# EasyEDA Pro project boat_2.eprj

# Schematic Schematic
Board Name: Boat_V_2; Create Date: 2025-10-07; Page Name: P1; Project Name: boat_2; Schematic Name: Schematic; Update Date: 2026-01-03; Company: EasyEDA.com; Page Size: A4; Version: V1.0
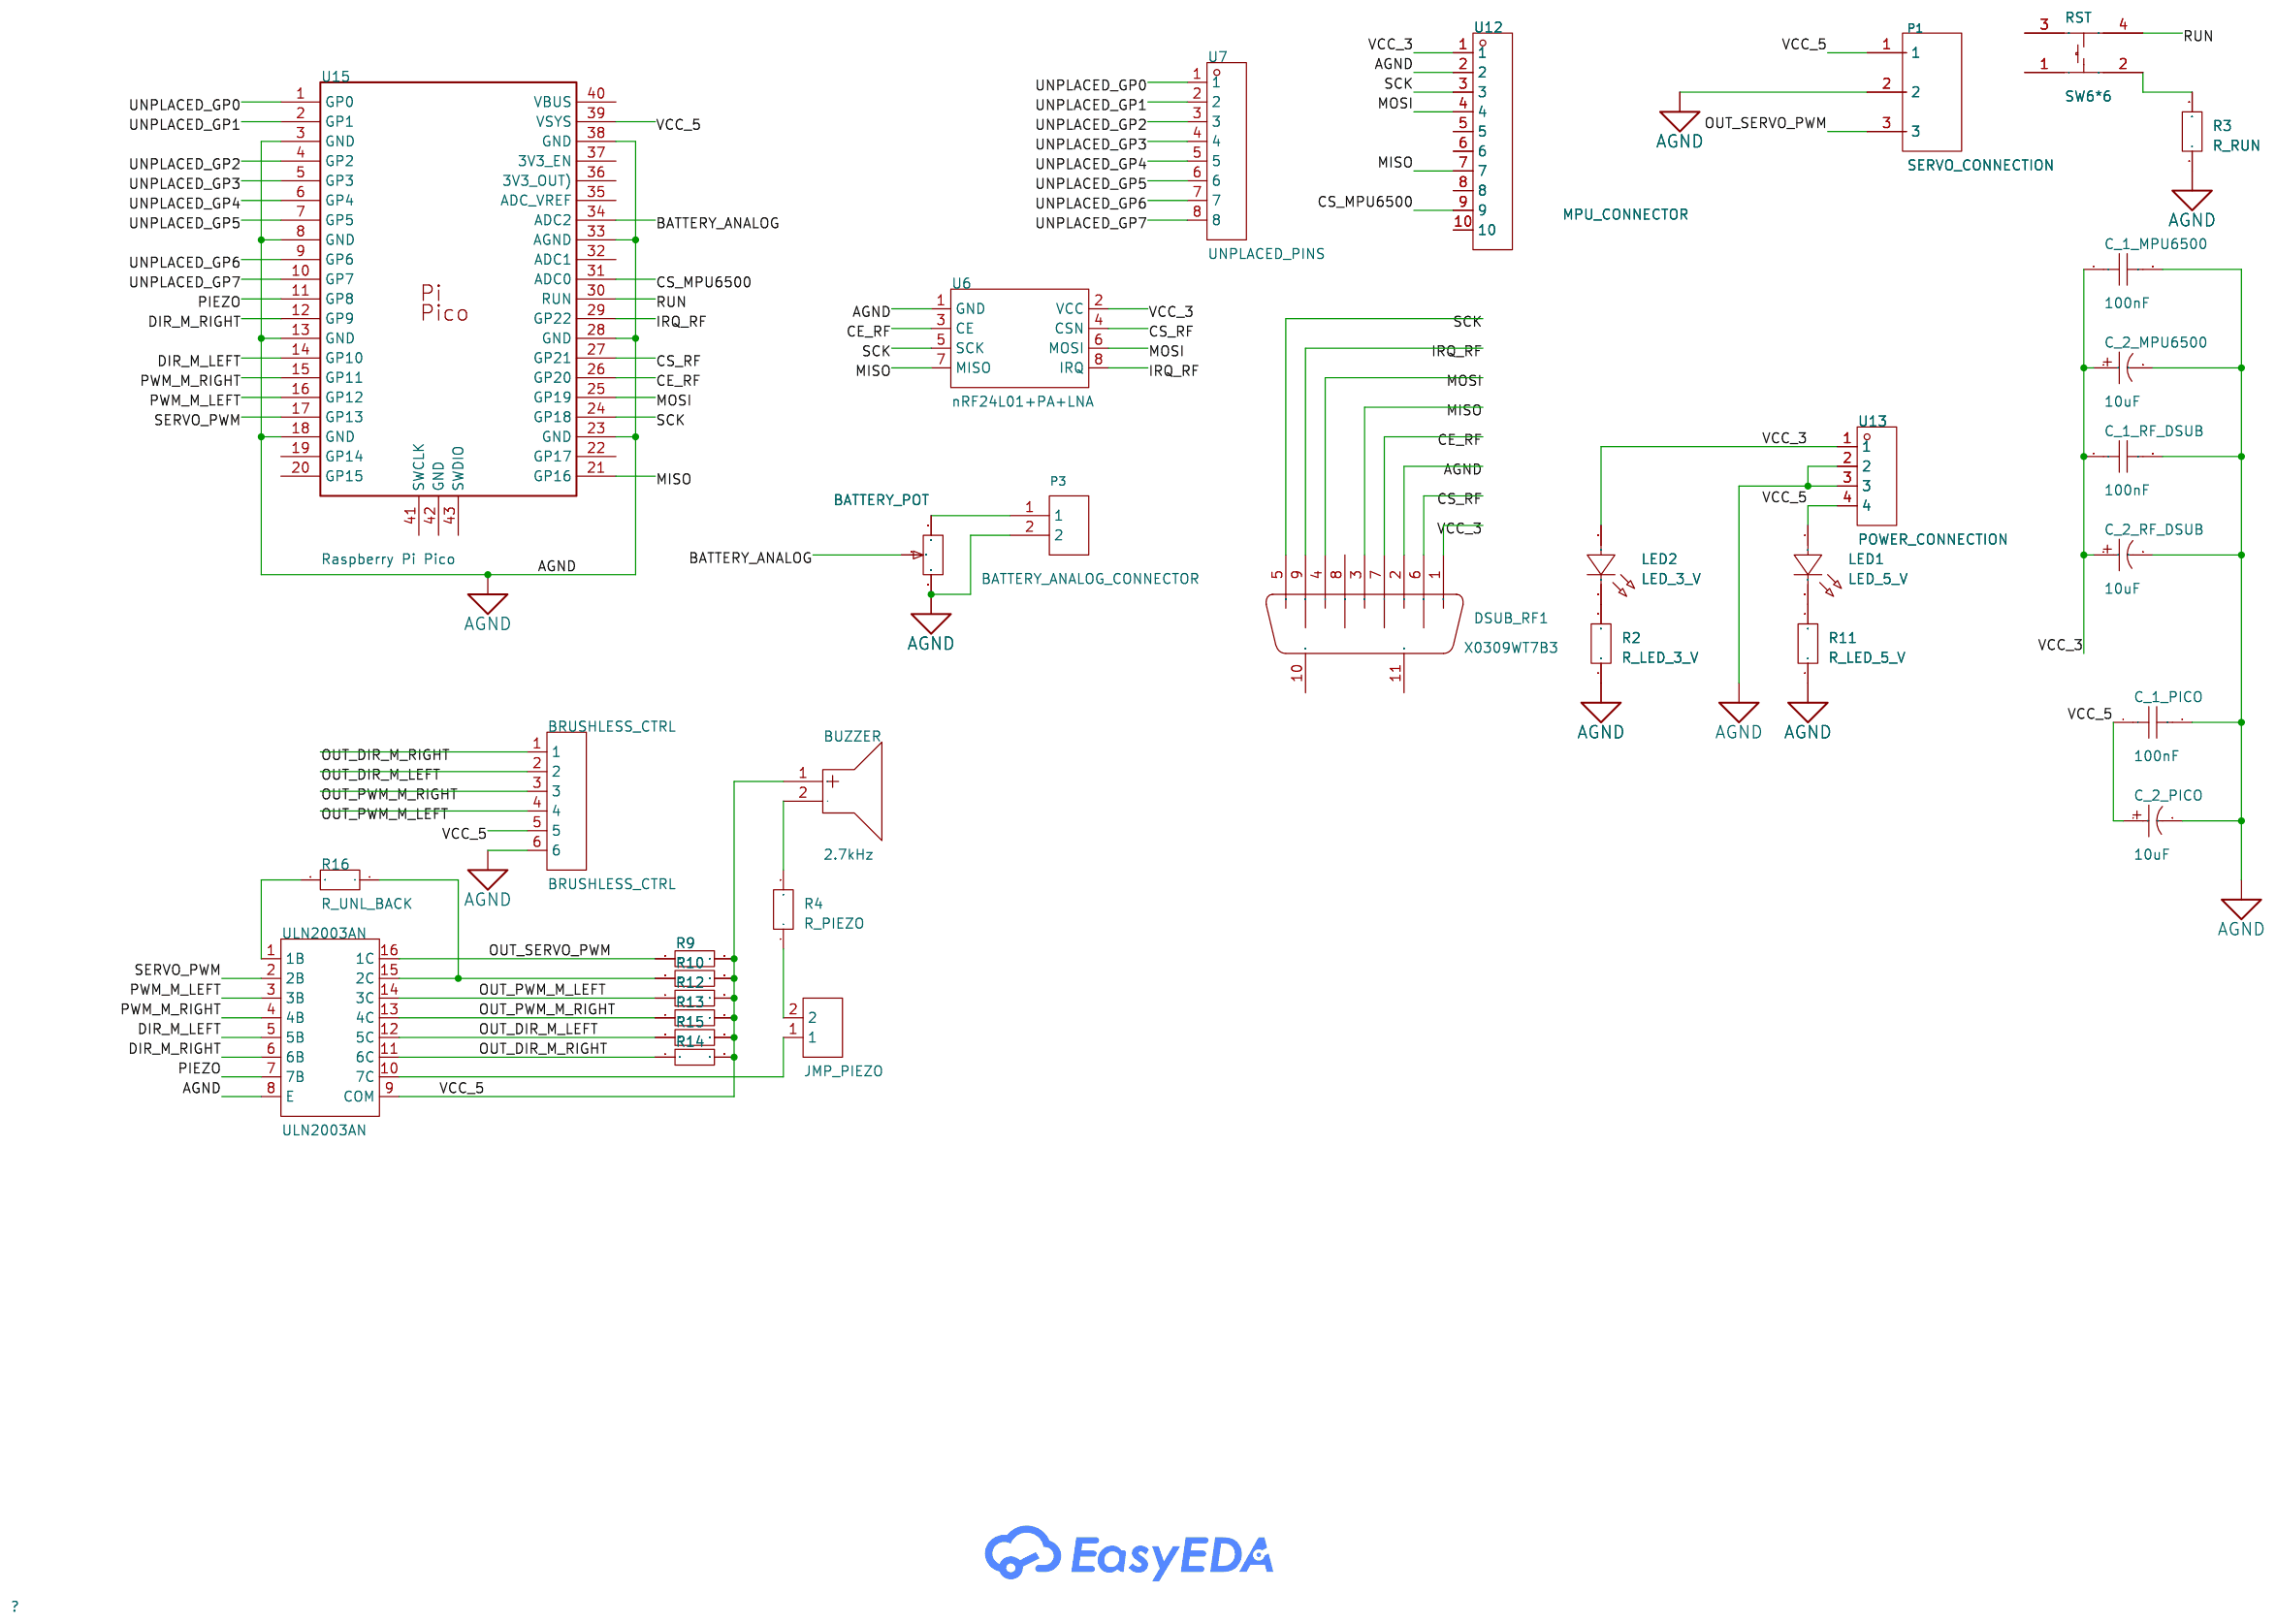
[diagram p0: schematic sheet]

## Parts
BRUSHLESS_CTRL  BRUSHLESS_CTRL  [CONN-TH_6P-P2.50_BX-XH2.54-6PZZ]
BUZZER  2.7kHz  [BUZ-TH_BD9.0-P5.00-D0.6-FD]
C_1_MPU6500  100nF  [CAP-TH_L5.8-W3.6-P5.0-D0.6]
C_1_PICO  100nF  [CAP-TH_L5.8-W3.6-P5.0-D0.6]
C_1_RF_DSUB  100nF  [CAP-TH_L5.8-W3.6-P5.0-D0.6]
C_2_MPU6500  10uF  [CAP-TH_BD5.0-P2.00-D0.5-FD]
C_2_PICO  10uF  [CAP-TH_BD5.0-P2.00-D0.5-FD]
C_2_RF_DSUB  10uF  [CAP-TH_BD5.0-P2.00-D0.5-FD]
DSUB_RF1  X0309WT7B3  [DB9-TH_X0309WT7B3]
H2  JMP_PIEZO  [HDR-TH_2P-P2.54-V-M]
LED1  LED_5_V  [LED-TH_BD5.5-P2.54_SFH-4545]
LED2  LED_3_V  [LED-TH_BD5.5-P2.54_SFH-4545]
P1  SERVO_CONNECTION  [CONN-TH_3P-P5.00_WJ126V-5.0-3P]
P3  BATTERY_ANALOG_CONNECTOR  [CONN-TH_2P-P5.00_WJ301V-5.00-2P]
R1  20kΩ  [RES-ADJ-TH_3296X]
R2  10kΩ  [RES-TH_BD2.7-L6.2-P10.20-D0.4]
R3  10kΩ  [RES-TH_BD2.7-L6.2-P10.20-D0.4]
R4  10kΩ  [RES-TH_BD2.7-L6.2-P10.20-D0.4]
R9  UNL_PULLUP  [RES-TH_BD2.7-L6.2-P10.20-D0.4]
R10  UNL_PULLUP  [RES-TH_BD2.7-L6.2-P10.20-D0.4]
R11  10kΩ  [RES-TH_BD2.7-L6.2-P10.20-D0.4]
R12  UNL_PULLUP  [RES-TH_BD2.7-L6.2-P10.20-D0.4]
R13  UNL_PULLUP  [RES-TH_BD2.7-L6.2-P10.20-D0.4]
R14  UNL_PULLUP  [RES-TH_BD2.7-L6.2-P10.20-D0.4]
R15  UNL_PULLUP  [RES-TH_BD2.7-L6.2-P10.20-D0.4]
R16  10kΩ  [RES-TH_BD2.7-L6.2-P10.20-D0.4]
RST  SW6*6  [KEY-TH_4P-L6.0-W6.0-P4.5-LS6.5-TL]
U6  nRF24L01+PA+LNA  [COMM-TH_L41.0-W15.5-P2.54_NRF24L01]
U7  UNPLACED_PINS  [HDR-TH_8P-P2.54-V-F]
U12  MPU_CONNECTOR  [HDR-TH_10P-P2.54-V-F]
U13  POWER_CONNECTION  [CONN-TH_DB128V-5.0-4P]
U15  Raspberry Pi Pico  [RASPBERRY PI PICO FOOTPRINT]
ULN2003AN  ULN2003AN  [DIP-16_L19.7-W6.6-P2.54-LS7.6-BL]

## Library data of the parts
BRUSHLESS_CTRL = BX-XH2.54-6PZZ: LCSC Part Name: 1x6P 间距:2.5mm 直插 系列:XH; Supplier Part: C18077837; Manufacturer: Bossie(博锡); Supplier Footprint: 插件,P=2.54mm; JLCPCB Part Class: Extended Part; Datasheet: https://item.szlcsc.com/datasheet/BX-XH2.54-6PZZ/19218238.html; Supplier: LCSC; Pins Structure: 1x6P; Pitch: 2.5mm; Mounting Type: Through Hole; Reference Series: XH; Number of Pins: 6P; Number of Rows: 1; Number of PINs Per Row: 6; Current Rating: 3A; Contact Material: Brass; Contact Plating: Tin; Operating Temperature: -25℃~+85℃; Voltage Rating: 250V; Plastic Material: PA66; Flame Retardant Rating: UL94V-0; Color: White; Z-Height of the Board: 7mm; X-Length of Bottom Edge on Board (Spacing Line): 17.5mm; Y-Width of Bottom Edge on Board: 5.9mm
BUZZER = FMB09A03-3V: LCSC Part Name: 电磁式3V 2700HZ; Supplier Part: C417385; Manufacturer: FUET(福声科技); Supplier Footprint: 插件,D=9mm; JLCPCB Part Class: Extended Part; Datasheet: https://item.szlcsc.com/datasheet/FMB09A03-3V/410518.html; Supplier: LCSC; Driver Circuitry: Active Buzzer (Built-in Driving Circuit); Technology: Electromagnetic; Voltage - Supply: 2V~4.2V; Sound Pressure Level(SPL): 80dB; Diameter(φD): 9mm; Height: 5.7mm
C_1_MPU6500 C_1_PICO C_1_RF_DSUB = 178MU0002: LCSC Part Name: 100nF ±10% 50V; Supplier Part: C5632426; Manufacturer: KNSCHA(科尼盛); Supplier Footprint: 插件,P=5.08mm; JLCPCB Part Class: Extended Part; Datasheet: https://item.szlcsc.com/datasheet/178MU0002/6552581.html; Supplier: LCSC; Tolerance: ±10%; Voltage Rating: 50V; Temperature Coefficient: X7R; Pin Spacing: 5.08mm
C_2_MPU6500 C_2_PICO C_2_RF_DSUB = 35ZLH220MEFC8X11.5: LCSC Part Name: 220uF ±20% 35V; Supplier Part: C107639; Manufacturer: Rubycon(红宝石); Supplier Footprint: 插件,D8xL11.5mm; JLCPCB Part Class: Extended Part; Datasheet: https://item.szlcsc.com/datasheet/35ZLH220MEFC8X11.5/108858.html; Supplier: LCSC; Tolerance: ±20%; Voltage Rating: 35V; Ripple Current: 472.5mA@120Hz; Pin Spacing: 3.5mm; Diameter: 8mm; Height - Seated (Max): 11.5mm; Lifetime: 8000hrs@105℃; Operating Temperature: -40℃~+105℃
DSUB_RF1 = X0309WT7B3: Connector Type:常规D-Sub Gender:Male Number of Pins:9P Mounting Style:Bend insert Number of Rows:2 Current Rating-Signal (Max):5A Current Rating-Power (Max):- Rated Voltage (Max):250V Colour:Black Operating Temperature Range:-55℃~+105℃ Operating Temperature; LCSC Part Name: D-Sub 公 P数:9P; Supplier Part: C2917296; Manufacturer: XKB Connection(中国星坤); Supplier Footprint: 弯插; JLCPCB Part Class: Extended Part; Datasheet: https://atta.szlcsc.com/upload/public/pdf/source/20220330/3C975A3D9B2321449830197EB58FD303.pdf; Supplier: LCSC; Connector Type: 常规D-Sub; Gender: Male; Number of Pins: 9P; Mounting Style: Bend insert; Number of Rows: 2; Current Rating-Signal (Max): 5A; Rated Voltage (Max): 250V; Colour: Black; Operating Temperature Range: -55℃~+105℃
H2 = PZ254V-11-02P: LCSC Part Name: 1x2P 间距:2.54mm 方针 直插; Supplier Part: C492401; Manufacturer: XFCN(兴飞); Supplier Footprint: 插件,P=2.54mm; JLCPCB Part Class: Extended Part; Datasheet: https://item.szlcsc.com/datasheet/PZ254V-11-02P/502957.html; Supplier: LCSC; Pin Structure: 1x2P; Pitch: 2.54mm; Circluar Pins/Square Pins: Pin Header; Mounting Type: Through Hole; Number of Rows: 1; Number of Pins: 2P; Length of Mating Pin: 6mm; Insulation Height: 2.5mm; Length of End Connection Pin: 3mm; Contact Material: Brass; Operating Temperature: -40℃~+105℃; Color: Black
LED1 LED2 = SLR-56MG3F: LCSC Part Name: 普绿/黄绿; Supplier Part: C2846650; Manufacturer: ROHM(罗姆); Supplier Footprint: 插件,D=5mm; JLCPCB Part Class: Extended Part; Datasheet: https://item.szlcsc.com/datasheet/SLR-56MG3F/3041319.html; Supplier: LCSC; Lamp Holder Type: 5mm Round Lens; Illumination Color: Yellow Green; Power(Watts): 75mW; Forward Current: 10mA; Peak Wavelength: 563nm; Viewing Angle: 40°; Operating Temperature: -20℃~+85℃
P1 = WJ126V-5.0-3P: LCSC Part Name: 5mm 1x3P 排数:1 每排P数:3 直插; Supplier Part: C8401; Manufacturer: KANGNEX(康奈克斯电气); Supplier Footprint: 插件,P=5mm; JLCPCB Part Class: Extended Part; Datasheet: https://atta.szlcsc.com/upload/public/pdf/source/20191225/C8401_BC4AEF85CCBF7CDF5CCE64583ADD1E63.pdf; Supplier: LCSC; Structure: 1x3P; Pitch: 5mm; Color: Green; Mounting Style: Straight; Current Rating (Max): 18A; Voltage Rating (Max): 250V; Number of Pins: 3P; Number of Rows: 1; Wire Gauge - AWG: 14~26; Wire Gauge - mm2: 2.5; Number of PINs Per Row: 3; Operating Temperature Range: -40℃~+105℃
P3 = WJ301V-5.0-2P: LCSC Part Name: 5mm 1x2P 排数:1 每排P数:2 直插; Supplier Part: C8475; Manufacturer: KANGNEX(康奈克斯电气); Supplier Footprint: 插件,P=5mm; JLCPCB Part Class: Extended Part; Datasheet: https://item.szlcsc.com/datasheet/WJ301V-5.0-2P/8969.html; Supplier: LCSC; Number of Positions or Pins: 1x2P; Pitch: 5mm; Color: Blue; Mounting Type: Through Hole; Number of Pins: 2P; Number of Rows: 1; Number of PINs Per Row: 2; Current Rating: 17.5A; Voltage Rating (Max): 250V; Wire Gauge - AWG: 14~22; Wire Gauge - mm2: 1.5; Operating Temperature: -30℃~+120℃
R1 = 3296X-203: LCSC Part Name: 3296X 20KΩ±10%; Supplier Part: C48641797; Manufacturer: BAOTER(宝特); Supplier Footprint: 插件-3P,9.5x4.8mm; JLCPCB Part Class: Extended Part; Datasheet: https://item.szlcsc.com/datasheet/3296X-203/50920059.html; Supplier: LCSC; Tolerance: ±10%; Power(Watts): 500mW; Temperature Coefficient: ±250ppm/℃; Number of Turns: 28
R2-R4 R11 R16 = MF02SFF1002A10: Supplier Part: C20625289; Manufacturer: UNI-ROYAL(厚声); Supplier Footprint: DIP; JLCPCB Part Class: Extended Part; Datasheet: https://item.szlcsc.com/datasheet/MF02SFF1002A10/22028782.html; Supplier: LCSC; Type: Metal Film Resistor; Tolerance: ±1%; Power(Watts): 2W; Temperature Coefficient: ±50ppm/℃
R9 R10 R12-R15 = Res_0603: Supplier Footprint: 0603
RST = SW6*6: Supplier Part: C9900009250; Supplier Footprint: SW-TH; JLCPCB Part Class: Extended Part; Supplier: LCSC
U6 = nRF24L01+PA+LNA: Supplier Part: C9900187674; JLCPCB Part Class: Extended Part; Supplier: LCSC
U7 = 8Pin排母,间距2.54mm,高5.0mm: Supplier Part: C9900020870; Supplier Footprint: HDR-TH; JLCPCB Part Class: Extended Part; Supplier: LCSC
U12 = PM254-1-10-Z-8.5: LCSC Part Name: 1x10P 间距:2.54mm 直插; Supplier Part: C2897373; Manufacturer: HCTL(华灿天禄); Supplier Footprint: 插件,P=2.54mm; JLCPCB Part Class: Extended Part; Datasheet: https://item.szlcsc.com/datasheet/PM254-1-10-Z-8.5/3142378.html; Supplier: LCSC; Holes Structure: 1x10P; Pitch: 2.54mm; Circular Hole / Square Hole: Square Hole; Mounting Type: Through Hole; Number of Rows: 1; Number of Positions: 10P; Current Rating: 3A; Holes Direction: Top; Insulation Height: 8.5mm; Contact Material: Copper Alloy; Operating Temperature: -40℃~+105℃
U13 = DB128V-5.0-4P-GN-S: LCSC Part Name: 1x4P 5mm 直插 排数:1 每排P数:4; Supplier Part: C424682; Manufacturer: DORABO(地博电气); Supplier Footprint: 插件,P=5mm; JLCPCB Part Class: Extended Part; Datasheet: https://item.szlcsc.com/datasheet/DB128V-5.0-4P-GN-S/418351.html; Supplier: LCSC; Number of Positions or Pins: 1x4P; Pitch: 5mm; Color: Green; Mounting Type: Through Hole; Number of Pins: 4P; Number of Rows: 1; Number of PINs Per Row: 4; Screw Specification: M2.5; Current Rating: 16A; Voltage Rating (Max): 300V; Wire Gauge - AWG: 12~22; Wire Gauge - mm2: 2.5; Operating Temperature: -40℃~+105℃
U15 = Raspberry Pi Pico: Manufacturer: Raspberry Pi; Manufacturer Part: Pi Pico; Supplier: Core Electronics; Supplier Part: Pi Pico; link: https://www.raspberrypi.org/documentation/rp2040/getting-started/
ULN2003AN = ULN2003AN_C7432319: LCSC Part Name: 七路高增益达林顿阵列功率驱动集成电路; Supplier Part: C7432319; Manufacturer: HGSEMI(华冠); Supplier Footprint: DIP-16; JLCPCB Part Class: Extended Part; Datasheet: https://item.szlcsc.com/datasheet/ULN2003AN/8436768.html; Supplier: LCSC; number of channels: 7; Collector - Emitter Voltage VCEO: 50V; Current - Collector(Ic): 500mA; Voltage - Input(Max): 30V; Operating Temperature: -40℃~+85℃; Output Leakage Current(Icex): 20uA; Input Current(on): 0.93mA; Input Current(off): 100uA

## Nets
AGND: BRUSHLESS_CTRL.6 C_1_MPU6500.2 C_1_PICO.2 C_1_RF_DSUB.2 C_2_MPU6500.2 C_2_PICO.2 C_2_RF_DSUB.2 DSUB_RF1.2 P1.2 P3.2 R1.3 R2.1 R3.1 R11.1 U6.1(GND) U12.2 U13.2 U13.3 U15.3(GND) U15.8(GND) U15.13(GND) U15.18(GND) U15.23(GND) U15.28(GND) U15.33(AGND) U15.38(GND) ULN2003AN.8(E)
VCC_3: C_1_MPU6500.1 C_1_RF_DSUB.1 C_2_MPU6500.1 C_2_RF_DSUB.1 DSUB_RF1.1 LED2.1(A) U6.2(VCC) U12.1 U13.1
VCC_5: BRUSHLESS_CTRL.5 BUZZER.1(+) C_1_PICO.1 C_2_PICO.1 LED1.1(A) P1.1 R9.2 R10.2 R12.2 R13.2 R14.2 R15.2 U13.4 U15.39(VSYS) ULN2003AN.9(COM)
BATTERY_ANALOG: R1.2 U15.34(ADC2)
CE_RF: DSUB_RF1.7 U6.3(CE) U15.26(GP20)
CS_MPU6500: U12.9 U15.31(ADC0)
CS_RF: DSUB_RF1.6 U6.4(CSN) U15.27(GP21)
DIR_M_LEFT: U15.14(GP10) ULN2003AN.5(5B)
DIR_M_RIGHT: U15.12(GP9) ULN2003AN.6(6B)
IRQ_RF: DSUB_RF1.9 U6.8(IRQ) U15.29(GP22)
MISO: DSUB_RF1.3 U6.7(MISO) U12.7 U15.21(GP16)
MOSI: DSUB_RF1.4 U6.6(MOSI) U12.4 U15.25(GP19)
OUT_DIR_M_LEFT: BRUSHLESS_CTRL.2 R15.1 ULN2003AN.12(5C)
OUT_DIR_M_RIGHT: BRUSHLESS_CTRL.1 R14.1 ULN2003AN.11(6C)
OUT_PWM_M_LEFT: BRUSHLESS_CTRL.4 R12.1 ULN2003AN.14(3C)
OUT_PWM_M_RIGHT: BRUSHLESS_CTRL.3 R13.1 ULN2003AN.13(4C)
OUT_SERVO_PWM: P1.3 R9.1 ULN2003AN.16(1C)
PIEZO: U15.11(GP8) ULN2003AN.7(7B)
PWM_M_LEFT: U15.16(GP12) ULN2003AN.3(3B)
PWM_M_RIGHT: U15.15(GP11) ULN2003AN.4(4B)
RUN: RST.4 U15.30(RUN)
SCK: DSUB_RF1.5 U6.5(SCK) U12.3 U15.24(GP18)
SERVO_PWM: U15.17(GP13) ULN2003AN.2(2B)
UNPLACED_GP0: U7.1 U15.1(GP0)
UNPLACED_GP1: U7.2 U15.2(GP1)
UNPLACED_GP2: U7.3 U15.4(GP2)
UNPLACED_GP3: U7.4 U15.5(GP3)
UNPLACED_GP4: U7.5 U15.6(GP4)
UNPLACED_GP5: U7.6 U15.7(GP5)
UNPLACED_GP6: U7.7 U15.9(GP6)
UNPLACED_GP7: U7.8 U15.10(GP7)
$1N9361: P3.1 R1.1
$1N9603: LED1.2(K) R11.2
$1N9605: LED2.2(K) R2.2
$1N10835: H2.2 R4.1
$1N10839: BUZZER.2(-) R4.2
$1N17067: R3.2 RST.2
$1N18863: R16.2 ULN2003AN.1(1B)
$1N18894: H2.1 ULN2003AN.10(7C)
$1N18898: R10.1 R16.1 ULN2003AN.15(2C)

Not connected (* = marked no-connect by the designer): DSUB_RF1 8 10(MH1) 11(MH2); RST 1 3; U12 5 6 8 10; U15 19(GP14) 20(GP15) 22(GP17) 32(ADC1) 35(ADC VREF) 36(3V3 OUT)) 37(3V3_EN) 40(VBUS) 41(SWCLK) 42(GND) 43(SWDIO)

# Board PCB3
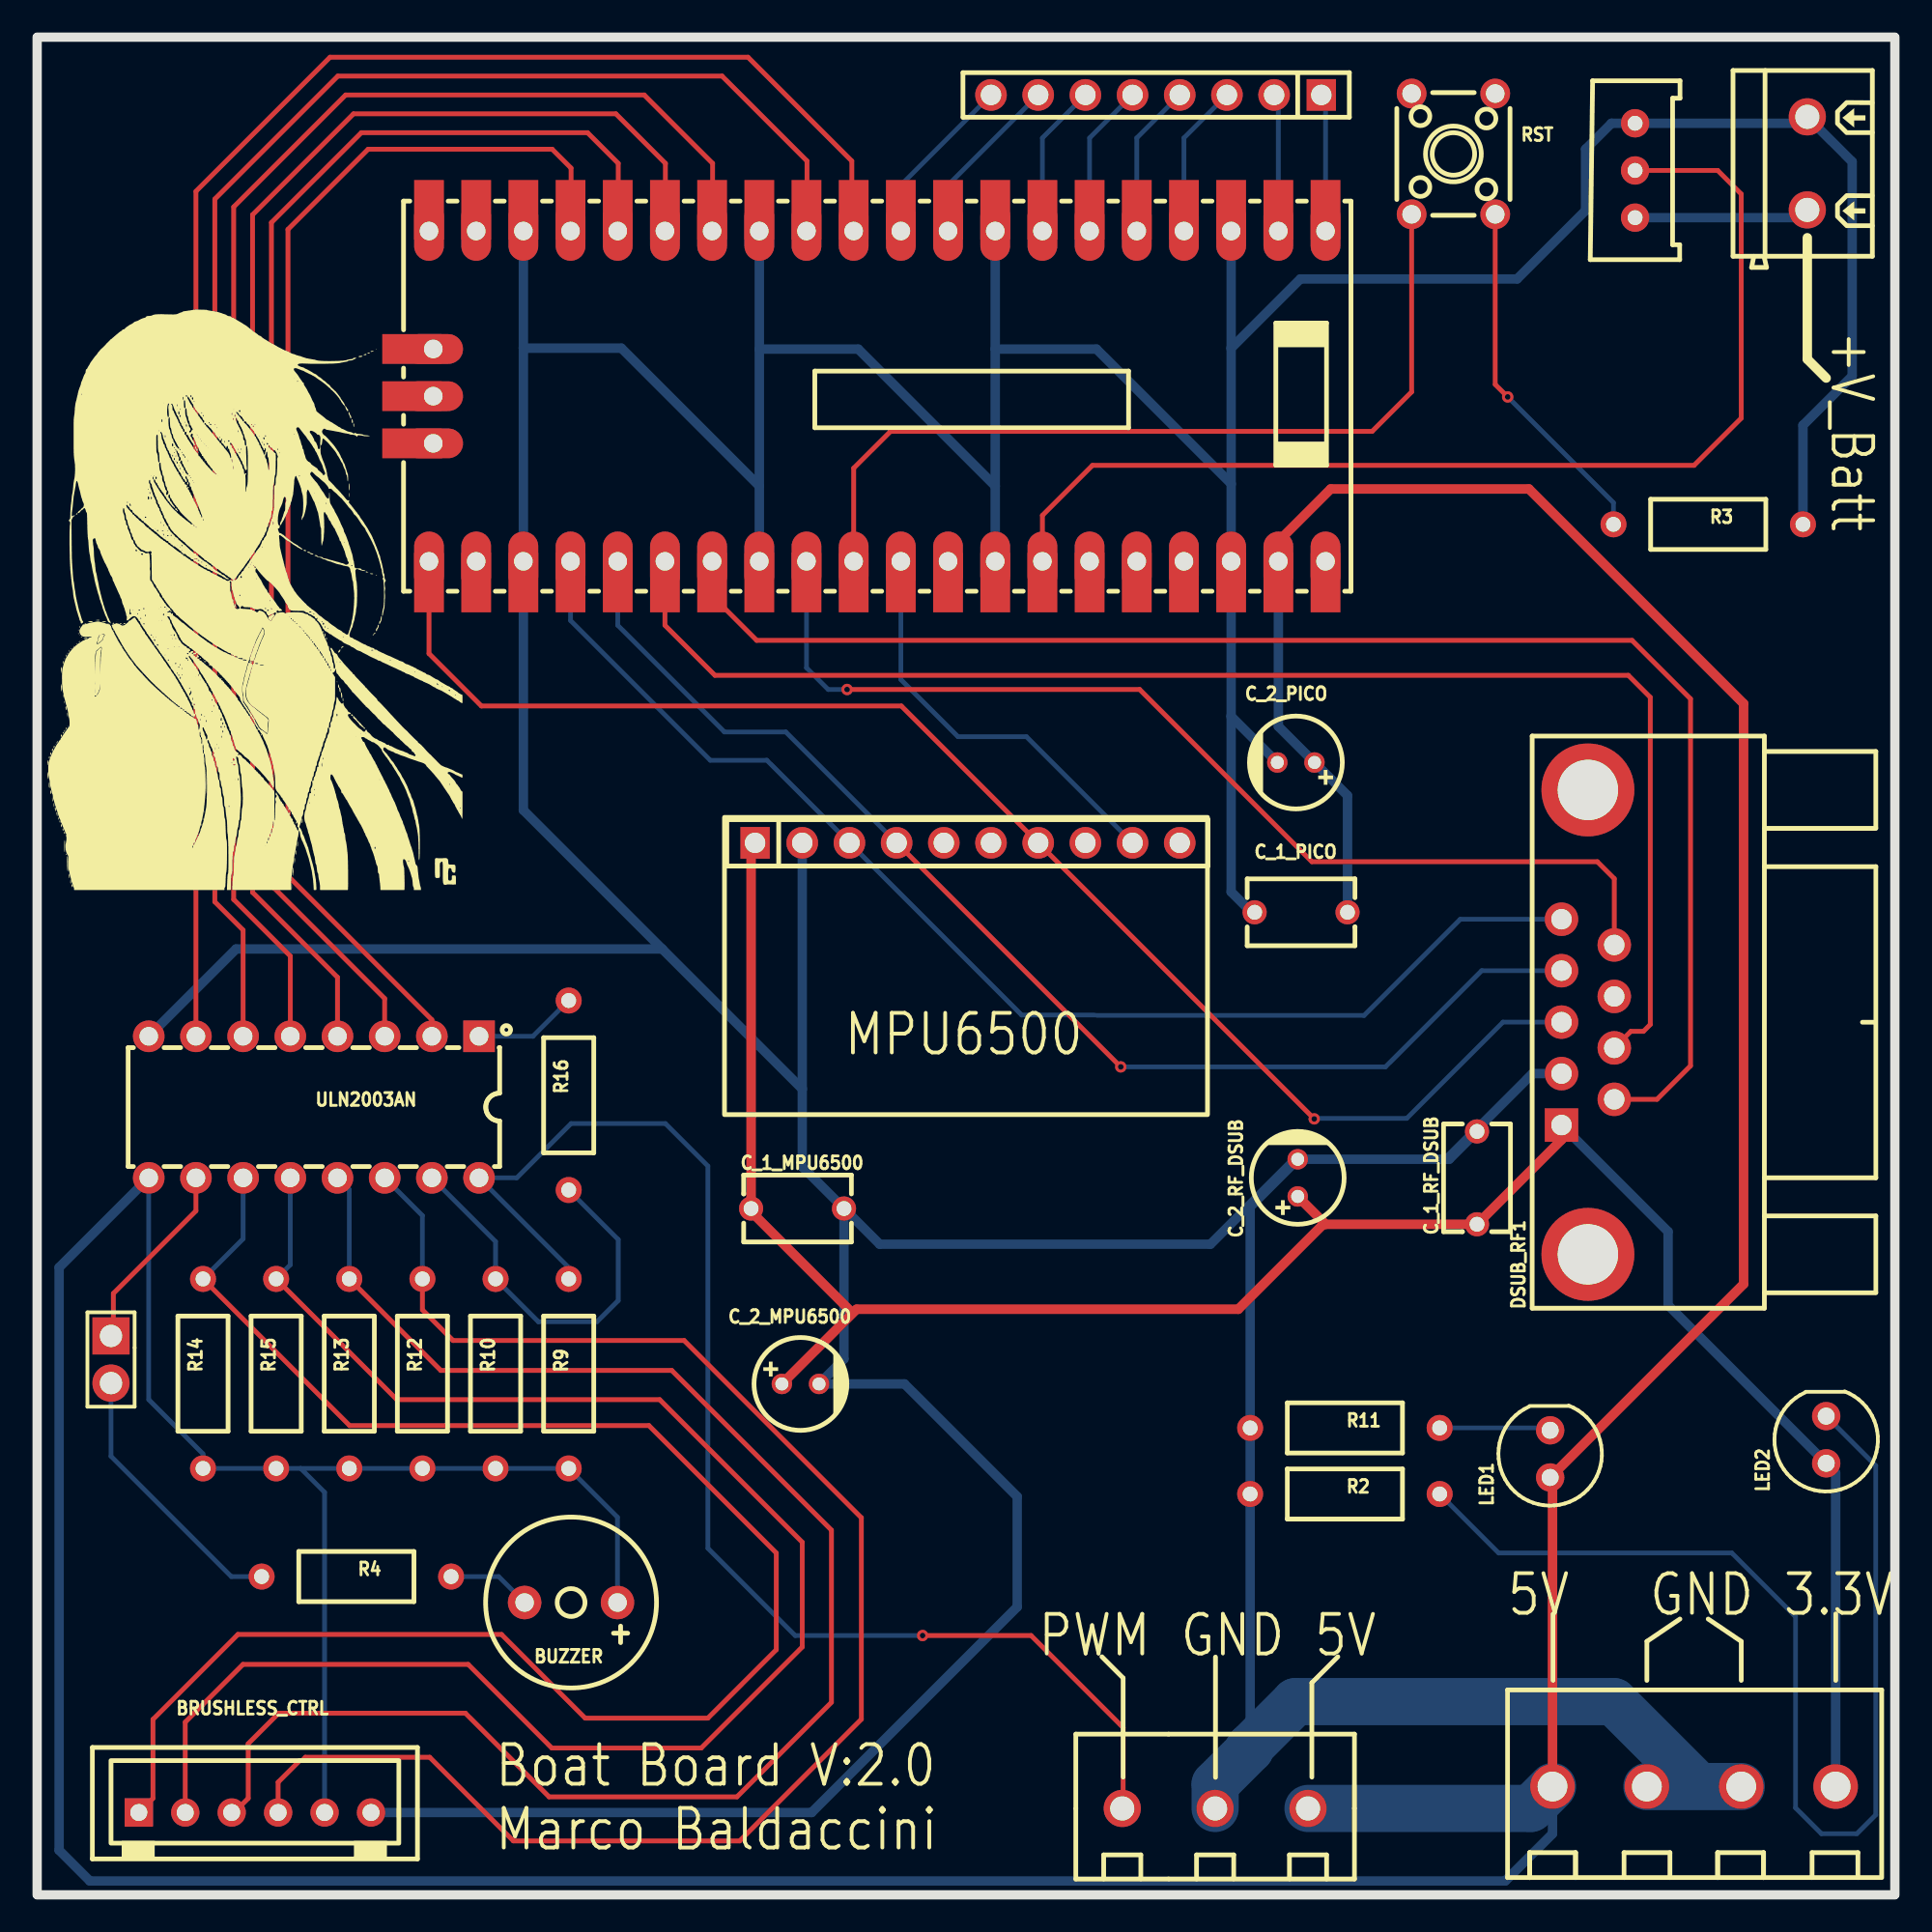
[diagram p1: board, top side]
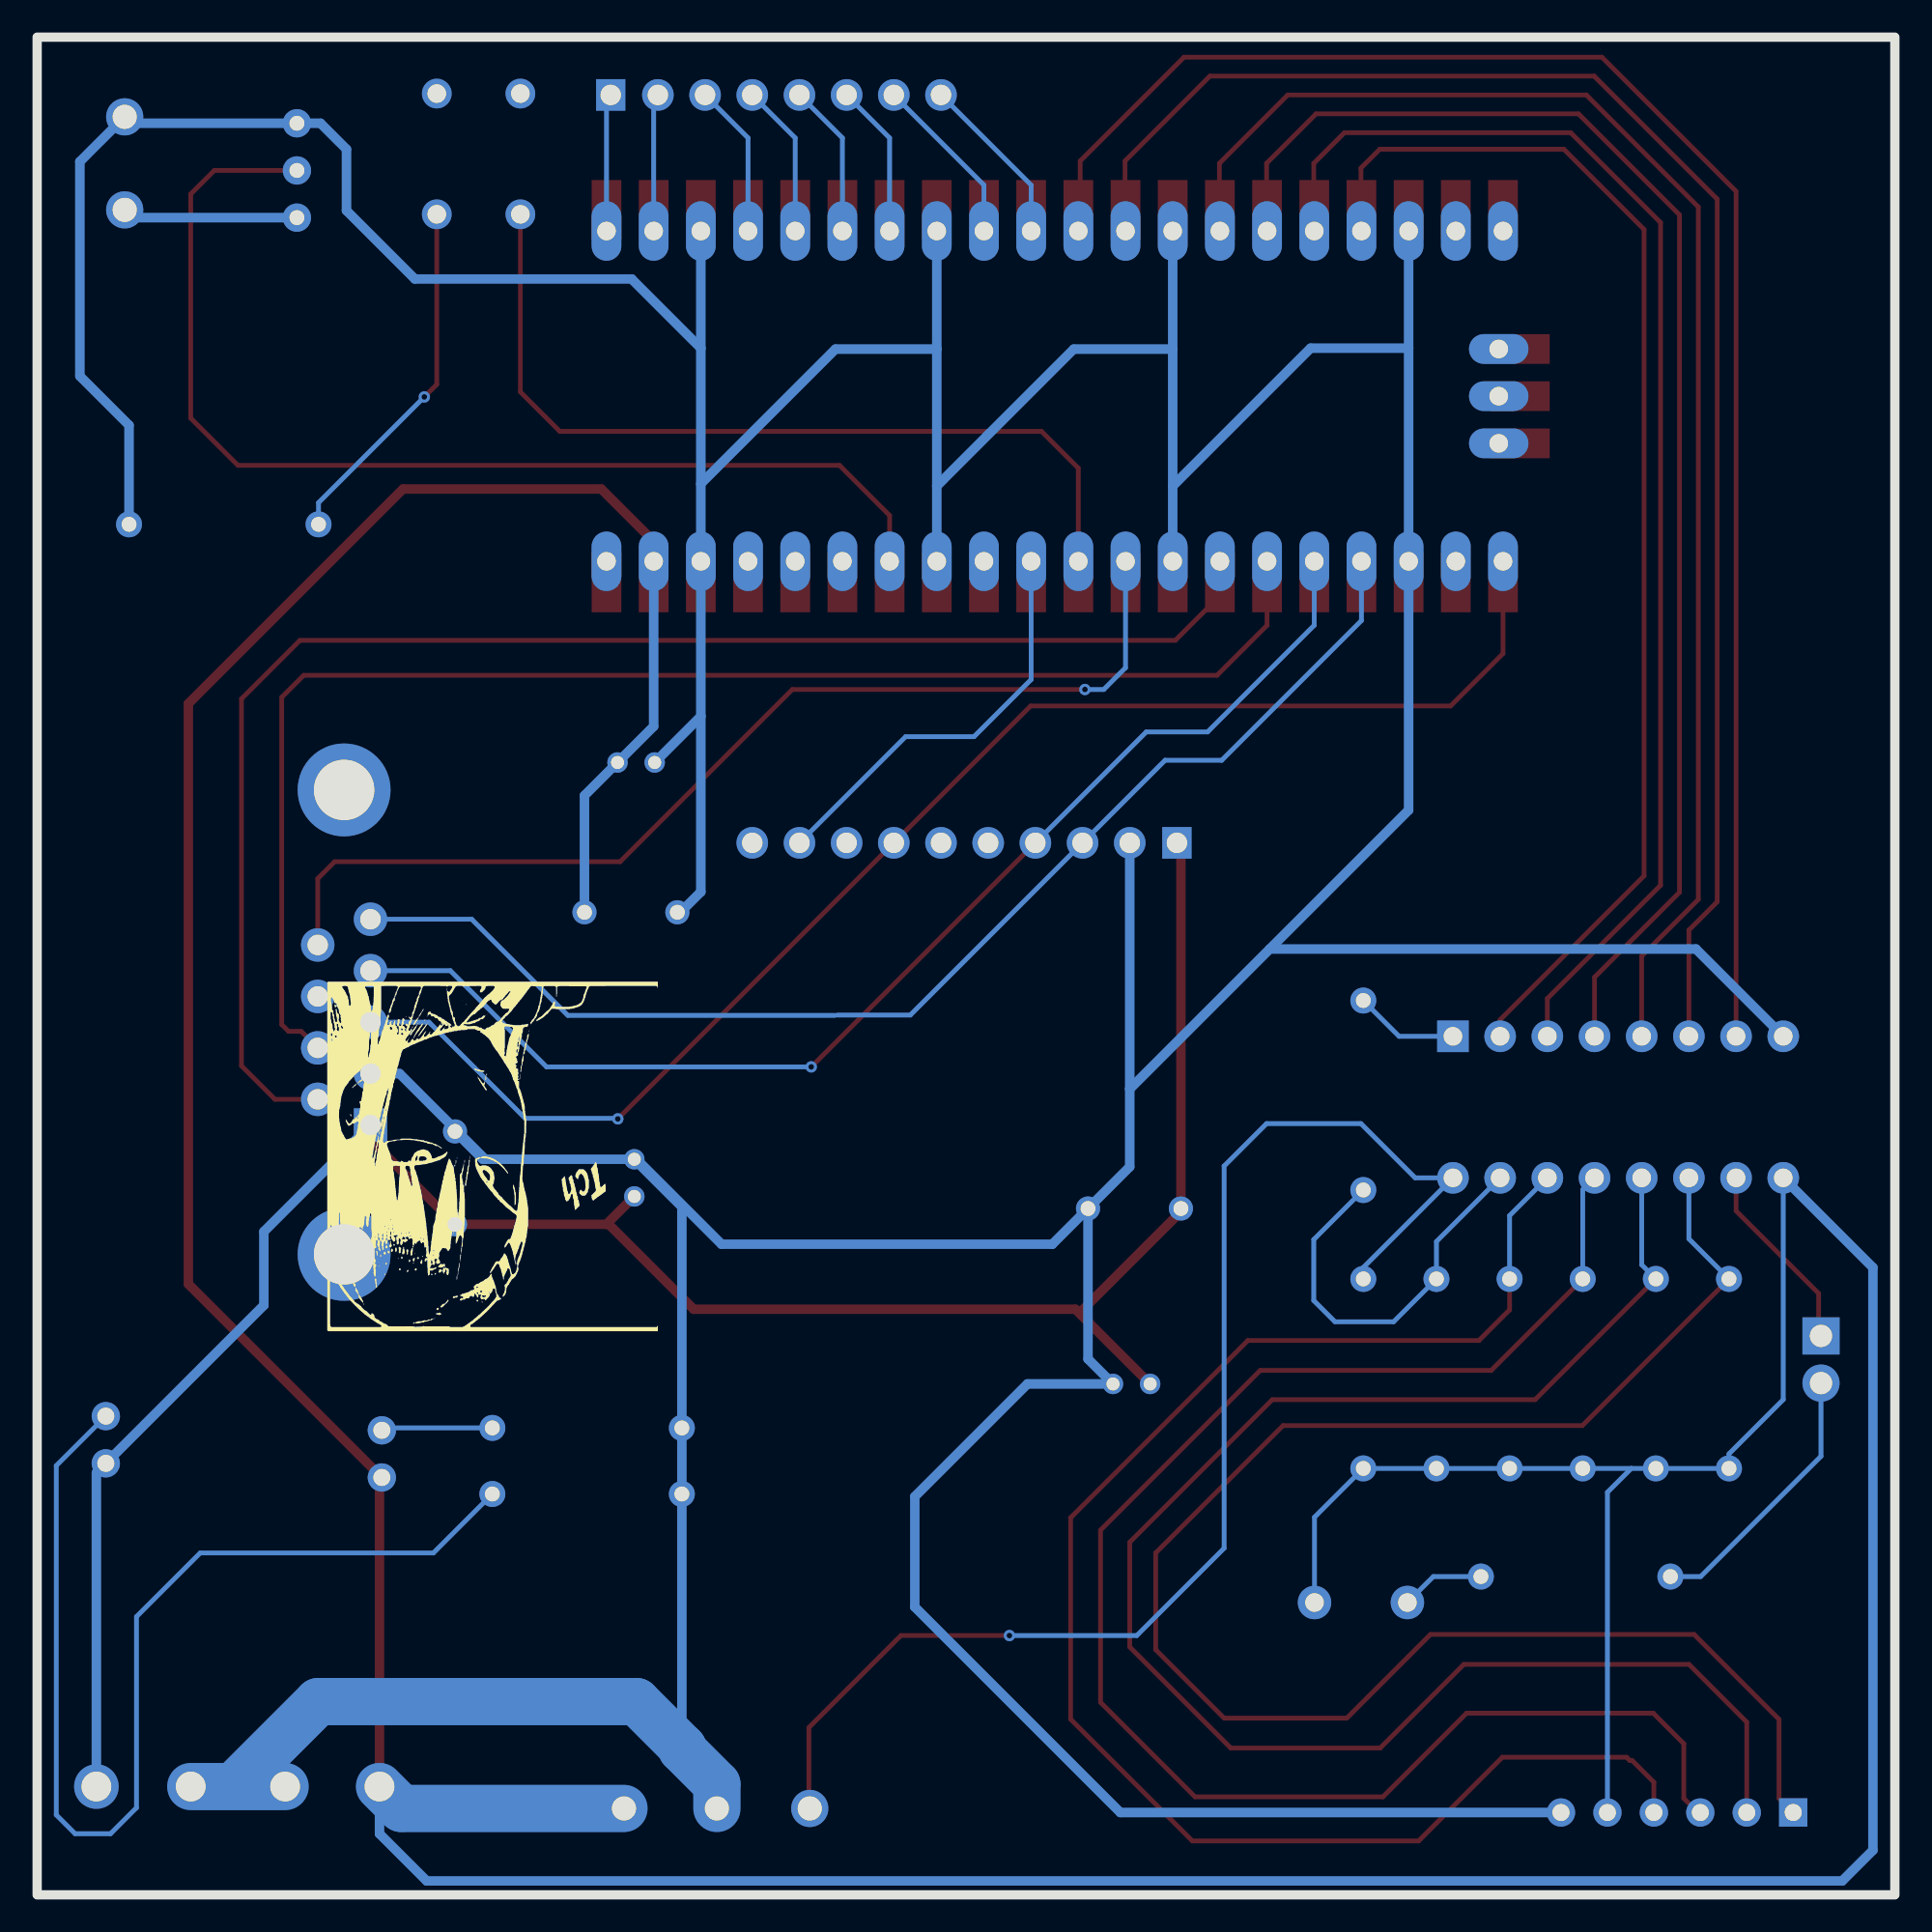
[diagram p2: board, bottom side, seen from below]

Outline 100 x 100 mm; copper layers: Top Layer, Bottom Layer. Coordinates in mm from the lower left corner of the outline.
Outline path: rectangle 0,100 100,0
Stack: Top Layer 0.035mm / Dielectric1 1.51mm FR4 er 4.5 / Bottom Layer 0.035mm

## Design rules (mm)
template: JLCPCB Capability(Two Layers Board)
spacing copperThickness1oz (default): track to track 0.102, other pairs 0.152 to 0.3
spacing copperThickness2oz: track to track 0.203, other pairs 0.152 to 0.3
track width copperThickness1oz (default): min 0.127, default 0.254, max 2.54
track width copperThickness2oz: min 0.203, default 0.254, max 2.54
differential pair differentialPair (default): width min 0.127, default 0.254, max 2.54; gap min 0.152, default 0.152
via viaSize (default): diameter min 0.5, default 0.61, max 10; hole min 0.3, default 0.305, max 6.3

## Placement (name value [footprint] x y rotation side)
BRUSHLESS_CTRL  BRUSHLESS_CTRL  [CONN-TH_6P-P2.50_BX-XH2.54-6PZZ]  11.72 4.43 0 top
BUZZER  2.7kHz  [BUZ-TH_BD9.0-P5.00-D0.6-FD]  28.74 15.74 180 top
C_1_MPU6500  100nF  [CAP-TH_L5.8-W3.6-P5.0-D0.6]  40.93 36.94 0 top
C_1_PICO  100nF  [CAP-TH_L5.8-W3.6-P5.0-D0.6]  68.04 52.89 180 top
C_1_RF_DSUB  100nF  [CAP-TH_L5.8-W3.6-P5.0-D0.6]  77.51 38.6 90 top
C_2_MPU6500  10uF  [CAP-TH_BD5.0-P2.00-D0.5-FD]  41.09 27.5 0 top
C_2_PICO  10uF  [CAP-TH_BD5.0-P2.00-D0.5-FD]  67.76 60.95 180 top
C_2_RF_DSUB  10uF  [CAP-TH_BD5.0-P2.00-D0.5-FD]  67.86 38.6 90 top
DSUB_RF1  X0309WT7B3  [DB9-TH_X0309WT7B3]  83.48 46.98 90 top
H2  JMP_PIEZO  [HDR-TH_2P-P2.54-V-M]  3.97 28.82 270 top
LED1  LED_5_V  [LED-TH_BD5.5-P2.54_SFH-4545]  81.44 23.74 90 top
LED2  LED_3_V  [LED-TH_BD5.5-P2.54_SFH-4545]  96.3 24.5 90 top
P1  SERVO_CONNECTION  [CONN-TH_3P-P5.00_WJ126V-5.0-3P]  63.41 4.81 0 top
P3  BATTERY_ANALOG_CONNECTOR  [CONN-TH_2P-P5.00_WJ301V-5.00-2P]  95.29 93.21 90 top
R1  20kΩ  [RES-ADJ-TH_3296X]  86.02 92.83 180 top
R2  10kΩ  [RES-TH_BD2.7-L6.2-P10.20-D0.4]  70.4 21.58 0 top
R3  10kΩ  [RES-TH_BD2.7-L6.2-P10.20-D0.4]  89.95 73.78 180 top
R4  10kΩ  [RES-TH_BD2.7-L6.2-P10.20-D0.4]  17.18 17.13 0 top
R9  UNL_PULLUP  [RES-TH_BD2.7-L6.2-P10.20-D0.4]  28.61 28.06 270 top
R10  UNL_PULLUP  [RES-TH_BD2.7-L6.2-P10.20-D0.4]  24.68 28.06 270 top
R11  10kΩ  [RES-TH_BD2.7-L6.2-P10.20-D0.4]  70.4 25.13 0 top
R12  UNL_PULLUP  [RES-TH_BD2.7-L6.2-P10.20-D0.4]  20.74 28.06 270 top
R13  UNL_PULLUP  [RES-TH_BD2.7-L6.2-P10.20-D0.4]  16.8 28.06 270 top
R14  UNL_PULLUP  [RES-TH_BD2.7-L6.2-P10.20-D0.4]  8.93 28.06 270 top
R15  UNL_PULLUP  [RES-TH_BD2.7-L6.2-P10.20-D0.4]  12.86 28.06 270 top
R16  10kΩ  [RES-TH_BD2.7-L6.2-P10.20-D0.4]  28.61 43.04 90 top
RST  SW6*6  [KEY-TH_4P-L6.0-W6.0-P4.5-LS6.5-TL]  76.24 93.71 270 top
U7  UNPLACED_PINS  [HDR-TH_8P-P2.54-V-F]  60.24 96.89 180 top
U12  MPU_CONNECTOR  [HDR-TH_10P-P2.54-V-F]  50.08 56.63 0 top
U13  POWER_CONNECTION  [CONN-TH_DB128V-5.0-4P]  89.19 5.83 180 top
U15  Raspberry Pi Pico  [RASPBERRY PI PICO FOOTPRINT]  19.72 91.17 270 top
ULN2003AN  ULN2003AN  [DIP-16_L19.7-W6.6-P2.54-LS7.6-BL]  14.9 42.41 180 top

## Footprints (pads in the part's own frame, mm; a bottom-side part is the same pattern mirrored in y, then rotated)
BUZ-TH_BD9.0-P5.00-D0.6-FD
  round 1.8 hole 1: 1(-2.5,0) 2(2.5,0)
CAP-TH_BD5.0-P2.00-D0.5-FD
  round 1.1 hole 0.7: 1(-1,0) 2(1,0)
CAP-TH_L5.8-W3.6-P5.0-D0.6
  round 1.3 hole 0.8: 1(-2.5,0) 2(2.5,0)
CONN-TH_2P-P5.00_WJ301V-5.00-2P
  round 2 hole 1.3: 1(-2.505,0) 2(2.505,0)
CONN-TH_3P-P5.00_WJ126V-5.0-3P
  round 2 hole 1.3: 1(5,-0.163) 2(-0.002,-0.163) 3(-5,-0.163)
CONN-TH_6P-P2.50_BX-XH2.54-6PZZ
  rect 1.524x1.524 hole 0.914: 1(-6.25,0)
  round 1.524 hole 0.914: 2(-3.75,0) 3(-1.25,0) 4(1.25,0) 5(3.75,0) 6(6.25,0)
CONN-TH_DB128V-5.0-4P
  round 2.4 hole 1.6: 1(-7.62,0) 2(-2.54,0) 3(2.54,0) 4(7.62,0)
DB9-TH_X0309WT7B3
  rect 1.8x1.8 hole 1.1: 1(-5.54,1.42)
  round 1.8 hole 1.1: 2(-2.77,1.42) 3(0,1.42) 4(2.77,1.42) 5(5.54,1.42) 6(-4.155,-1.42) 7(-1.385,-1.42) 8(1.385,-1.42) 9(4.155,-1.42)
  round 5 hole 3.25: 10(12.5,0) 11(-12.5,0)
DIP-16_L19.7-W6.6-P2.54-LS7.6-BL
  rect 1.7x1.7 hole 1: 1(-8.89,-3.81)
  round 1.7 hole 1: 2(-6.35,-3.81) 3(-3.81,-3.81) 4(-1.27,-3.81) 5(1.27,-3.81) 6(3.81,-3.81) 7(6.35,-3.81) 8(8.89,-3.81) 9(8.89,3.81) 10(6.35,3.81) 11(3.81,3.81) 12(1.27,3.81) 13(-1.27,3.81) 14(-3.81,3.81) 15(-6.35,3.81) 16(-8.89,3.81)
HDR-TH_2P-P2.54-V-M
  rect 2x2 hole 1.2: 1(-1.27,0)
  round 2 hole 1.2: 2(1.27,0)
HDR-TH_8P-P2.54-V-F
  rect 1.575x1.7 hole 1.1: 1(-8.89,0)
  round 1.7 hole 1.1: 2(-6.35,0) 3(-3.81,0) 4(-1.27,0) 5(1.27,0) 6(3.81,0) 7(6.35,0) 8(8.89,0)
HDR-TH_10P-P2.54-V-F
  rect 1.575x1.7 hole 1.1: 1(-11.43,0)
  round 1.7 hole 1.1: 2(-8.89,0) 3(-6.35,0) 4(-3.81,0) 5(-1.27,0) 6(1.27,0) 7(3.81,0) 8(6.35,0) 9(8.89,0) 10(11.43,0)
KEY-TH_4P-L6.0-W6.0-P4.5-LS6.5-TL
  round 1.6 hole 1: 1(-3.25,2.25) 2(3.25,2.25) 3(-3.25,-2.25) 4(3.25,-2.25)
LED-TH_BD5.5-P2.54_SFH-4545
  round 1.524 hole 0.914: 1(-1.27,0) 2(1.27,0)
RASPBERRY PI PICO FOOTPRINT
  rect 3.2x1.6 smd: 1(0.467,49.63) 2(0.467,47.09) 3(0.467,44.55) 4(0.467,42.01) 5(0.467,39.47) 6(0.467,36.93) 7(0.467,34.39) 8(0.467,31.85) 9(0.467,29.31) 10(0.467,26.77) 11(0.467,24.23) 12(0.467,21.69) 13(0.467,19.15) 14(0.467,16.61) 15(0.467,14.07) 16(0.467,11.53) 17(0.467,8.99) 18(0.467,6.45) 19(0.467,3.91) 20(0.467,1.37) 21(20.533,1.37) 22(20.533,3.91) 23(20.533,6.45) 24(20.533,8.99) 25(20.533,11.53) 26(20.533,14.07) 27(20.533,16.61) 28(20.533,19.15) 29(20.533,21.69) 30(20.533,24.23) 31(20.533,26.77) 32(20.533,29.31) 33(20.533,31.85) 34(20.533,34.39) 35(20.533,36.93) 36(20.533,39.47) 37(20.533,42.01) 38(20.533,44.55) 39(20.533,47.09) 40(20.533,49.63)
  oval 3.2x1.6 hole 1: 1(1.61,49.63) 2(1.61,47.09) 3(1.61,44.55) 4(1.61,42.01) 5(1.61,39.47) 6(1.61,36.93) 7(1.61,34.39) 8(1.61,31.85) 9(1.61,29.31) 10(1.61,26.77) 11(1.61,24.23) 12(1.61,21.69) 13(1.61,19.15) 14(1.61,16.61) 15(1.61,14.07) 16(1.61,11.53) 17(1.61,8.99) 18(1.61,6.45) 19(1.61,3.91) 20(1.61,1.37) 21(19.39,1.37) 22(19.39,3.91) 23(19.39,6.45) 24(19.39,8.99) 25(19.39,11.53) 26(19.39,14.07) 27(19.39,16.61) 28(19.39,19.15) 29(19.39,21.69) 30(19.39,24.23) 31(19.39,26.77) 32(19.39,29.31) 33(19.39,31.85) 34(19.39,34.39) 35(19.39,36.93) 36(19.39,39.47) 37(19.39,42.01) 38(19.39,44.55) 39(19.39,47.09) 40(19.39,49.63)
  oval 1.6x3.2 hole 1: 41(7.96,1.6) 42(10.5,1.6) 43(13.04,1.6)
  rect 1.6x3.2 smd: 41(7.96,0.457) 42(10.5,0.457) 43(13.04,0.457)
RES-ADJ-TH_3296X
  round 1.524 hole 0.8: 1(0,2.54) 2(0,0) 3(0,-2.54)
RES-TH_BD2.7-L6.2-P10.20-D0.4
  round 1.4 hole 0.8: 1(-5.1,0) 2(5.1,0)

## Nets
As in the schematic.

Pads without a net: DSUB_RF1 8 10 11; RST 1 3; U12 5 6 8 10; U15 19 20 22 32 35 36 37 40 41 42 43

## Via types
v1: diameter 0.61, hole 0.305, Top Layer to Bottom Layer, 5 vias

## Routing (per net, layer and track width the routed paths; a pad name or vN(x,y) marks a point on that pad's centre or on a via; arc(x,y) is an arc through that point)
AGND: length 470.9
  Bottom Layer w0.508: 64.27,75.96 57.03,83.21 51.57,83.21 ; 64.27,75.96 U15.38 64.27,63.44 ; 64.27,75.96 64.27,83.26 ; C_1_RF_DSUB.2 76.01,39.6 75.88,39.6 ; 64.27,63.44 64.27,53.99 65.37,52.89 C_1_PICO.2 ; 64.27,63.44 C_2_PICO.2 ; 26.17,83.26 31.45,83.26 38.87,75.83 ; 26.17,83.26 U15.23 26.17,58.39 33.65,50.92 ; 26.17,83.26 U15.18 ; 38.87,75.83 U15.28 ; 38.87,75.83 38.87,83.21 ; C_2_RF_DSUB.2 75.88,39.6 ; C_2_RF_DSUB.2 67.73,39.6 63.16,35.02 45.35,35.02 C_1_MPU6500.2 ; C_2_RF_DSUB.2 65.3,37.04 R11.1 R2.1 65.3,7.97 ; 75.88,39.6 80.49,44.21 82.06,44.21 ; 51.57,75.83 U15.33 ; 51.57,75.83 44.2,83.21 38.87,83.21 ; 51.57,75.83 51.57,83.21 ; ULN2003AN.8 10.71,50.92 33.65,50.92 ; 41.19,43.38 41.19,39.19 C_1_MPU6500.2 ; 41.19,43.38 U12.2 ; 41.19,43.38 33.65,50.92 ; 38.87,83.21 U15.13 ; 64.27,83.26 68,86.98 79.67,86.98 83.35,90.67 83.35,93.97 84.75,95.36 94.94,95.36 P3.2 97.7,93.3 97.7,81.76 95.05,79.11 R3.1 ; 64.27,83.26 U15.3 ; 51.57,83.21 U15.8 ; C_1_MPU6500.2 43.43,28.85 C_2_MPU6500.2 46.69,27.5 52.76,21.44 52.76,15.5 41.69,4.43 BRUSHLESS_CTRL.6
  Bottom Layer w2.54: 63.41,4.65 63.41,5.96 65.3,7.84 65.23,7.91 67.73,10.4 84.87,10.4 89.19,6.08 ; U13.2 U13.3
VCC_3: length 119.5
  Top Layer w0.508: 69.36,36.1 C_2_RF_DSUB.1 ; 69.36,36.1 69.23,36.1 64.66,31.52 44.11,31.52 C_2_MPU6500.1 ; 69.36,36.1 C_1_RF_DSUB.1 82.06,40.64 82.06,41.44 ; 43.73,31.48 38.43,36.78 C_1_MPU6500.1 38.43,56.42 U12.1
  Bottom Layer w0.508: 82.06,41.44 87.79,35.7 87.79,31.74 LED2.1 96.81,22.72 U13.1
VCC_5: length 315.6
  Top Layer w0.508: U13.4 81.57,22.34 81.44,22.47 91.86,32.88 91.86,64.12 80.3,75.68 69.63,75.68 66.81,72.86 U15.39
  Bottom Layer w0.254: 14.19,22.96 R15.2 R14.2 8.93,23.74 6.01,26.66 ULN2003AN.9 ; 14.19,22.96 15.47,21.67 BRUSHLESS_CTRL.5 ; 14.19,22.96 R13.2 R12.2 R10.2 R9.2 31.24,20.33 BUZZER.1
  Bottom Layer w0.508: C_1_PICO.1 70.54,59.18 C_2_PICO.1 66.81,62.9 U15.39 ; U13.4 81.57,3.29 79.03,0.75 2.83,0.75 1.18,2.4 1.18,33.77 ULN2003AN.9
  Bottom Layer w2.54: 68.41,4.65 80.39,4.65 U13.4
BATTERY_ANALOG: length 60.6
  Top Layer w0.254: R1.2 90.46,92.83 91.73,91.56 91.73,79.49 89.19,76.95 56.81,76.95 54.11,74.26 U15.34
CE_RF: length 78.2
  Top Layer w0.254: DSUB_RF1.7 85.79,46.48 86.47,46.48 86.84,46.85 86.84,64.46 85.65,65.65 36.49,65.65 33.79,68.34 U15.26
CS_MPU6500: length 22.5
  Bottom Layer w0.254: U15.31 46.49,65.42 49.57,62.34 53.25,62.34 U12.9
CS_RF: length 81.4
  Top Layer w0.254: U15.27 36.33,69.93 38.74,67.53 85.85,67.53 89,64.38 89,44.62 87.2,42.82 DSUB_RF1.6
DIR_M_LEFT: length 79.4
  Top Layer w0.254: U15.14 36.36,89.59 36.36,93.21 32.68,96.89 16.61,96.89 10.58,90.86 10.58,53.58 13.63,50.53 ULN2003AN.5
DIR_M_RIGHT: length 86
  Top Layer w0.254: U15.12 41.44,89.59 41.44,93.33 36.87,97.91 16.19,97.91 9.56,91.28 9.56,53.45 11.09,51.93 ULN2003AN.6
IRQ_RF: length 57.5
  Top Layer w0.254: v1(43.6,64.89) 59.35,64.89 68.62,55.61 83.99,55.61 84.9,54.7 DSUB_RF1.9
  Bottom Layer w0.254: v1(43.6,64.89) 42.58,64.89 41.41,66.06 U15.29
MISO: length 78.4
  Top Layer w0.254: U15.21 21.09,66.82 23.91,64 46.52,64 U12.7 v1(68.75,41.77)
  Bottom Layer w0.254: 82.06,46.98 78.91,46.98 73.73,41.8 68.77,41.8
MOSI: length 66.2
  Top Layer w0.254: U12.4 58.33,44.56
  Bottom Layer w0.254: 82.06,49.75 77.76,49.75 72.58,44.57 v1(58.33,44.57) ; U15.25 31.25,68.34 37,62.6 40.3,62.6 U12.4
OUT_DIR_M_LEFT: length 89.1
  Top Layer w0.254: R15.1 19.36,26.66 33.51,26.66 41.19,18.98 41.19,13.34 35.74,7.9 27.7,7.9 23.2,12.41 11.08,12.41 7.97,9.3 BRUSHLESS_CTRL.2
  Bottom Layer w0.254: ULN2003AN.12 13.63,33.92 R15.1
OUT_DIR_M_RIGHT: length 92.7
  Top Layer w0.254: BRUSHLESS_CTRL.1 6.23,5.19 6.23,9.44 10.81,14.02 25,14.02 29.5,9.51 36.11,9.51 39.79,13.2 39.79,18.4 32.93,25.26 16.82,25.26 R14.1
  Bottom Layer w0.254: R14.1 11.09,35.31 ULN2003AN.11
OUT_PWM_M_LEFT: length 85.2
  Top Layer w0.254: BRUSHLESS_CTRL.4 12.97,6.06 14.14,7.23 14.26,7.23 14.44,7.41 21.13,7.41 25.63,2.9 37.82,2.9 44.37,9.45 44.37,20.3 34.83,29.84 22.39,29.84 20.74,31.49 R12.1
  Bottom Layer w0.254: ULN2003AN.14 20.74,36.56 R12.1
OUT_PWM_M_RIGHT: length 86.7
  Top Layer w0.254: R13.1 21.73,28.23 34.16,28.23 42.76,19.63 42.76,10.36 37.67,5.28 27.56,5.28 23.05,9.78 13,9.78 11.36,8.14 11.36,5.19 10.6,4.43 BRUSHLESS_CTRL.3
  Bottom Layer w0.254: ULN2003AN.13 16.8,37.96 R13.1
OUT_SERVO_PWM: length 73.2
  Top Layer w0.254: v1(47.66,13.96) 53.5,13.96 58.46,9 58.46,4.7 58.41,4.65
  Bottom Layer w0.254: v1(47.66,13.96) 40.81,13.96 36.11,18.66 36.11,39.23 33.82,41.52 28.74,41.52 25.82,38.6 ULN2003AN.16 28.61,33.77 R9.1
PIEZO: length 89.9
  Top Layer w0.254: ULN2003AN.7 8.55,91.7 15.77,98.92 38.26,98.92 43.85,93.33 43.85,89.66 U15.11
PWM_M_LEFT: length 70.2
  Top Layer w0.254: U15.16 31.28,90.73 31.28,93.21 29.63,94.86 17.45,94.86 12.61,90.02 12.61,54.34 18.71,48.25 ULN2003AN.3
PWM_M_RIGHT: length 75.4
  Top Layer w0.254: U15.15 33.82,89.59 33.82,93.21 31.15,95.87 17.03,95.87 11.59,90.44 11.59,53.96 16.17,49.39 ULN2003AN.4
RUN: length 46.3
  Top Layer w0.254: RST.4 73.99,80.9 71.86,78.78 45.94,78.78 43.95,76.8 U15.30
SCK: length 67.3
  Bottom Layer w0.254: 82.06,52.52 76.61,52.52 71.43,47.34 57.06,47.34 ; 56.93,47.36 53,47.36 U12.3 39.28,61.08 36.23,61.08 28.71,68.59 U15.24
SERVO_PWM: length 66.3
  Top Layer w0.254: ULN2003AN.2 21.25,47.11 13.5,54.85 13.5,89.65 17.82,93.97 27.72,93.97 28.74,92.95 28.74,90.73 U15.17
UNPLACED_GP0: length 7.4
  Bottom Layer w0.254: U7.1 69.35,96.66 U15.1
UNPLACED_GP1: length 7.4
  Bottom Layer w0.254: U15.2 66.81,96.66 U7.2
UNPLACED_GP2: length 8.3
  Bottom Layer w0.254: U7.3 61.73,94.58 U15.4
UNPLACED_GP3: length 8.3
  Bottom Layer w0.254: U7.4 59.19,94.58 U15.5
UNPLACED_GP4: length 8.3
  Bottom Layer w0.254: U15.6 56.65,94.58 U7.5
UNPLACED_GP5: length 8.3
  Bottom Layer w0.254: U15.7 54.11,94.58 U7.6
UNPLACED_GP6: length 9.3
  Bottom Layer w0.254: U15.9 49.03,92.04 U7.7
UNPLACED_GP7: length 9.3
  Bottom Layer w0.254: U7.8 46.49,92.04 U15.10
$1N9361: length 9.4
  Bottom Layer w0.508: R1.1 94.87,90.28 P3.1
$1N9603: length 6
  Bottom Layer w0.254: R11.2 81.32,25.13 LED1.2
$1N9605: length 60.1
  Bottom Layer w0.254: R2.2 78.67,18.4 91.22,18.4 94.65,14.97 94.65,4.69 96.05,3.29 97.96,3.29 98.97,4.31 98.97,23.1 LED2.2
$1N10835: length 14.7
  Bottom Layer w0.254: H2.2 3.97,23.61 10.45,17.13 R4.1
$1N10839: length 4.5
  Bottom Layer w0.254: R4.2 24.84,17.13 BUZZER.2
$1N17067: length 19.3
  Top Layer w0.254: RST.2 78.49,81.3 v1(79.16,80.63)
  Bottom Layer w0.254: R3.2 84.85,74.94 v1(79.16,80.63)
$1N18863: length 5.6
  Bottom Layer w0.254: ULN2003AN.1 26.69,46.22 R16.2
$1N18894: length 10.4
  Top Layer w0.254: ULN2003AN.10 8.55,36.82 4.1,32.37 4.1,30.21 3.97,30.09
$1N18898: length 21.9
  Bottom Layer w0.254: R16.1 31.28,35.27 31.28,31.99 30.14,30.85 26.98,30.85 R10.1 24.68,35.17 ULN2003AN.15

## Text on the board
Top Silkscreen Layer: MPU6500 | PWM | GND | 5V | 3.3V | +V_Batt | Boat Board V:2.0 / Marco Baldaccini
